# Altium schematic sheet cambienmodbus.SchDoc
size A
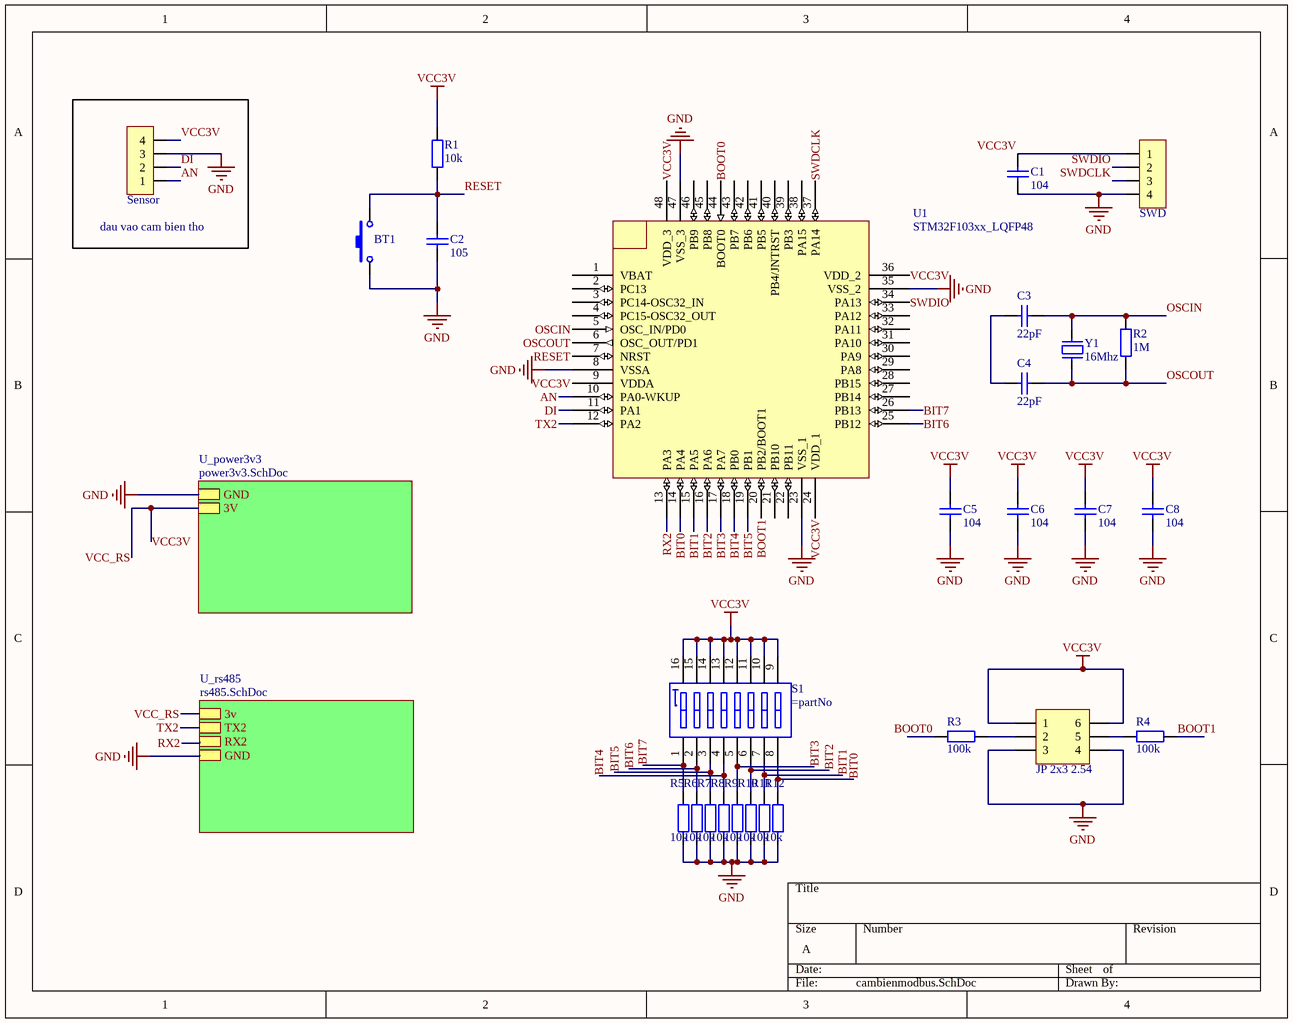
[diagram p0: cambienmodbus.SchDoc]

## Parts
BT1  Nut Nhan 2 Chan SMD 3x6x2.5  [Nut Nhan 2 Chan SMD 3x6x2.5]  (value not drawn)
C1  104  [tu 0603]
C2  105  [tu 0603]
C3  22pF  [tu 0603]
C4  22pF  [tu 0603]
C5  104  [tu 0603]
C6  104  [tu 0603]
C7  104  [tu 0603]
C8  104  [tu 0603]
JP1  Sensor  [JP 1x4 CC]
JP2  SWD  [JP 1x4 DT]
JP3  JP 2x3 2.54  [JP 2x3 DT]
R1  10k  [tro smd 0603]
R2  1M  [tro smd 0603]
R3  100k  [tro smd 0603]
R4  100k  [tro smd 0603]
R5  10k  [tro smd 0603]
R6  10k  [tro smd 0603]
R7  10k  [tro smd 0603]
R8  10k  [tro smd 0603]
R9  10k  [tro smd 0603]
R10  10k  [tro smd 0603]
R11  10k  [tro smd 0603]
R12  10k  [tro smd 0603]
S1  (no value)  [SW-DIP8]
U1  STM32F103xx_LQFP48  [STM32_LQPF48]
Y1  16Mhz  [Thach Anh 2 chan cam]

## Blocks framed on the sheet
dau vao cam bien tho: JP1

## Sub-sheets
U_power3v3 = power3v3.SchDoc: GND, 3V
U_rs485 = rs485.SchDoc: 3v, TX2, RX2, GND

## Nets
GND: BT1.1 C1.2 C2.2 C5.2 C6.2 C7.2 C8.2 JP1.3 JP2.4 JP3.3 JP3.4 R5.1 R6.1 R7.1 R8.1 R9.1 R10.1 R11.1 R12.1 U1.8(VSSA) U1.23(VSS_1) U1.35(VSS_2) U1.47(VSS_3) ; sheet U_rs485/GND, sheet U_power3v3/GND
VCC3V: C1.1 C5.1 C6.1 C7.1 C8.1 JP1.4 JP2.1 JP3.1 JP3.6 R1.2 S1.9 S1.10 S1.11 S1.12 S1.13 S1.14 S1.15 S1.16 U1.9(VDDA) U1.24(VDD_1) U1.36(VDD_2) U1.48(VDD_3) ; sheet U_rs485/3v, sheet U_power3v3/3V  [also labelled VCC_RS]
AN: JP1.1 U1.10(PA0-WKUP)
BIT0: R12.2 S1.8 U1.14(PA4)
BIT1: R11.2 S1.7 U1.15(PA5)
BIT2: R10.2 S1.6 U1.16(PA6)
BIT3: R9.2 S1.5 U1.17(PA7)
BIT4: R8.2 S1.4 U1.18(PB0)
BIT5: R7.2 S1.3 U1.19(PB1)
BIT6: R6.2 S1.2 U1.25(PB12)
BIT7: R5.2 S1.1 U1.26(PB13)
BOOT0: R3.1 U1.44(BOOT0)
BOOT1: R4.2 U1.20(PB2/BOOT1)
DI: JP1.2 U1.11(PA1)
OSCIN: C3.1 R2.2 U1.5(OSC_IN/PD0) Y1.2
OSCOUT: C4.1 R2.1 U1.6(OSC_OUT/PD1) Y1.1
RESET: BT1.2 C2.1 R1.1 U1.7(NRST)
RX2: U1.13(PA3) ; sheet U_rs485/RX2
SWDCLK: JP2.3 U1.37(PA14)
SWDIO: JP2.2 U1.34(PA13)
TX2: U1.12(PA2) ; sheet U_rs485/TX2
NetC3_2: C3.2 C4.2
NetJP3_2: JP3.2 R3.2
NetJP3_5: JP3.5 R4.1

Not connected (* = marked no-connect by the designer): U1 1(VBAT) 2(PC13) 3(PC14-OSC32_IN) 4(PC15-OSC32_OUT) 21(PB10) 22(PB11) 27(PB14) 28(PB15) 29(PA8) 30(PA9) 31(PA10) 32(PA11) 33(PA12) 38(PA15) 39(PB3) 40(PB4/JNTRST) 41(PB5) 42(PB6) 43(PB7) 45(PB8) 46(PB9)

## Library data of the parts
BT1 = Nut Nhan 2 Chan SMD 3x6x2.5: Ma_Hang: MH001036; Ten: Nút Nhấn 2 Chân 3x6x2.5MM SMD
C1 C5-C8 = Tu 0603 104 50V 10%: Dán; Don_Vi: Con; So_Chan: 2; Ten_Linh_Kien: Tụ 0603 104-100nF 10% 50V; Ma_Hang: MH004568; Chung_Loai: Dán; Kieu_Chan: *
C2 = Tu 0603 105 16V 20%: Dán; Don_Vi: Con; So_Chan: 2; Ten_Linh_Kien: Tụ 0603 105-1uF 20% 16V; Ma_Hang: MH004574; Chung_Loai: Dán; Kieu_Chan: *
C3 C4 = Tu 0603 22pF 50V 10%: Dán; Don_Vi: Con; So_Chan: 2; Ten_Linh_Kien: Tụ 0603 22pF 50V 10%; Ma_Hang: MH004570; Chung_Loai: Dán; Kieu_Chan: *
JP1 = JP 1x4 2.54 Cai Cong: Cắm; Ten_Linh_Kien: Jump Đơn Cái 2.54MM 1x40P Cong; Don_Vi: Con; Ma_Hang: MH001265; Ghi_Chu: *; Kieu_Chan: *; Chung_Loai: Cắm
JP2 = JP 1x4 2.54 Duc Thang: Cắm; Ten_Linh_Kien: Jump Đơn Đực 2.54MM 1x40P Thẳng 11MM; Don_Vi: Con; Ma_Hang: MH000903; Ghi_Chu: *; Kieu_Chan: *; Chung_Loai: Cắm
JP3 = JP 2x3 2.54 Duc Thang: Cắm; Ten_Linh_Kien: Jump Đôi Đực 2.54MM 2x40P Thẳng 11MM; Don_Vi: Con; Ma_Hang: MH002686; Ghi_Chu: *; Kieu_Chan: *; Chung_Loai: Cắm
R1 R5-R12 = Tro 0603 5% 10k: Dán; Don_Vi: Con; So_Chan: 2; Ten_Linh_Kien: Trở 0603 5% 10k; Ma_Hang: MH006316; Chung_Loai: Dán; Kieu_Chan: *
R2 = Tro 0603 5% 1M: Dán; Don_Vi: Con; So_Chan: 2; Ten_Linh_Kien: Trở 0603 5% 1M; Ma_Hang: MH006909; Chung_Loai: Dán; Kieu_Chan: *
R3 R4 = Tro 0603 5% 100k: Dán; So_Chan: 2; Ten_Linh_Kien: Trở 0603 5% 100k; Ma_Hang: MH006314; Don_Vi: Con; Chung_Loai: Dán; Kieu_Chan: *
S1 = SWDIP8: WS-DITV 2.54 mm small compact THT flat actuator with top tape; Manufacturer: Wurth Elektronik; Part No.: 418127160908; ComponentLink1 Description: Manufacturer; ComponentLink2 Description: Datasheet; Pole: 08; Created Date: Dec.2015; ComponentLink1URL: http://www.we-online.com; ComponentLink2URL: http://katalog.we-online.de/em/datasheet/4181271609xx.pdf; Created by: Baojun Chen
Y1 = Thach Anh 2 chan Cam: Crystal For all Crystal 2pin.; Value: 4Mhz
U1 = STM32F103xx_LQFP48: Published: 30-May-2008; DatasheetVersion: rev6, Mar-2008; PackageVersion: Mar-2008; PackageReference: LQFP48; Publisher: Altium Limited; PackageDescription: 48-Pin Low-Profile Quad Flat Pack, 7 x 7 mm Body, 0.5 mm Pitch (LQFP48); ComponentLink1Description: Manufacturer Link; ComponentLink1URL: www.st.com/stm32; ComponentLink2Description: Datasheet; ComponentLink2URL: http://www.st.com/stonline/products/literature/ds/13587.pdf